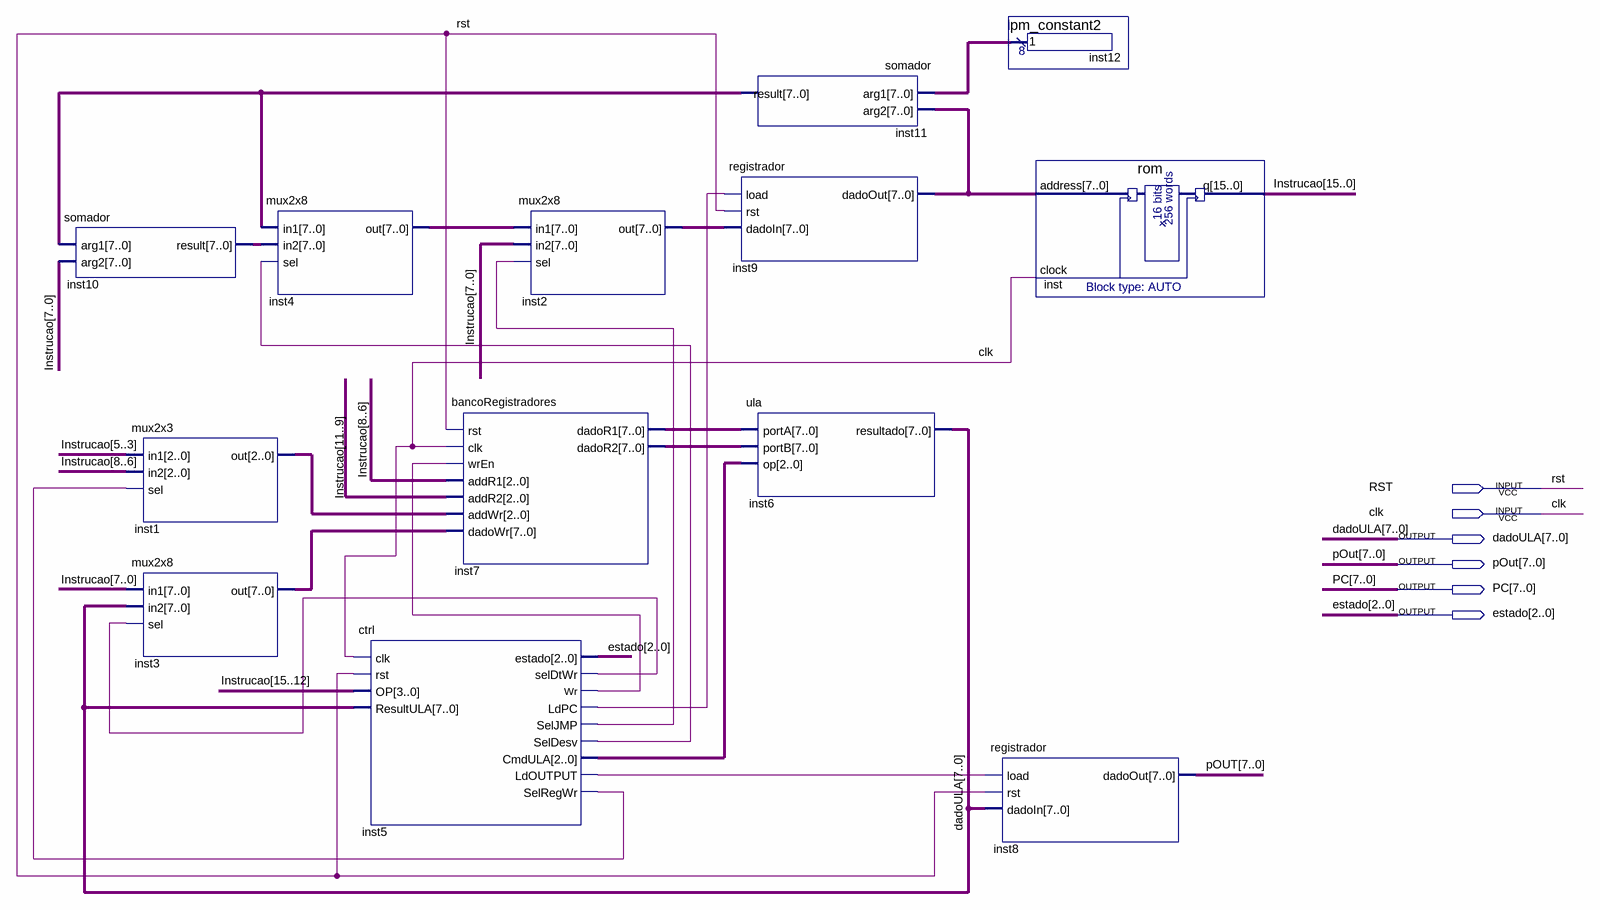
[diagram p0: schematic sheet]
// Quartus schematic processadorSch.bdf as structural Verilog: 13 symbols, 6 pins
module processadorSch (
  input  RST,
  input  clk,
  output [7:0] dadoULA,
  output [7:0] pOut,
  output [7:0] PC,
  output [2:0] estado
);

  wire inst5_ldoutput, inst5_ldpc, inst5_seldesv, inst5_seldtwr, inst5_seljmp, inst5_selregwr, inst5_wr;
  wire [2:0] inst1_out, inst5_cmdula;
  wire [7:0] inst2_out, inst3_out, inst4_out, inst7_dador1, inst7_dador2, inst9_dadoout, inst10_result,
       inst11_result, inst12_result;
  wire [15:0] Instrucao;

  somador inst10 (.arg1(inst11_result), .arg2(Instrucao[7:0]), .result(inst10_result));
  mux2x3 inst1 (.in1(Instrucao[5:3]), .in2(Instrucao[8:6]), .sel(inst5_selregwr), .out(inst1_out));
  mux2x8 inst3 (.in1(Instrucao[7:0]), .in2(dadoULA), .sel(inst5_seldtwr), .out(inst3_out));
  mux2x8 inst4 (.in1(inst11_result), .in2(inst10_result), .sel(inst5_seldesv), .out(inst4_out));
  ctrl inst5 (
    .clk(clk), .rst(RST), .OP(Instrucao[15:12]), .ResultULA(dadoULA), .estado(estado),
    .selDtWr(inst5_seldtwr), .Wr(inst5_wr), .LdPC(inst5_ldpc), .SelJMP(inst5_seljmp),
    .SelDesv(inst5_seldesv), .CmdULA(inst5_cmdula), .LdOUTPUT(inst5_ldoutput), .SelRegWr(inst5_selregwr));
  bancoRegistradores inst7 (
    .rst(RST), .clk(clk), .wrEn(inst5_wr), .addR1(Instrucao[8:6]), .addR2(Instrucao[11:9]),
    .addWr(inst1_out), .dadoWr(inst3_out), .dadoR1(inst7_dador1), .dadoR2(inst7_dador2));
  mux2x8 inst2 (.in1(inst4_out), .in2(Instrucao[7:0]), .sel(inst5_seljmp), .out(inst2_out));
  registrador inst9 (.load(inst5_ldpc), .rst(RST), .dadoIn(inst2_out), .dadoOut(inst9_dadoout));
  somador inst11 (.arg1(inst12_result), .arg2(inst9_dadoout), .result(inst11_result));
  ula inst6 (.portA(inst7_dador1), .portB(inst7_dador2), .op(inst5_cmdula), .resultado(dadoULA));
  registrador inst8 (.load(inst5_ldoutput), .rst(RST), .dadoIn(dadoULA), .dadoOut(pOut));
  lpm_constant2 inst12 (.result(inst12_result));
  rom inst (.address(inst9_dadoout), .clock(clk), .q(Instrucao));
endmodule
